# EAGLE design 8Bit-audio-7524-axelb (EAGLE 9.6.2)
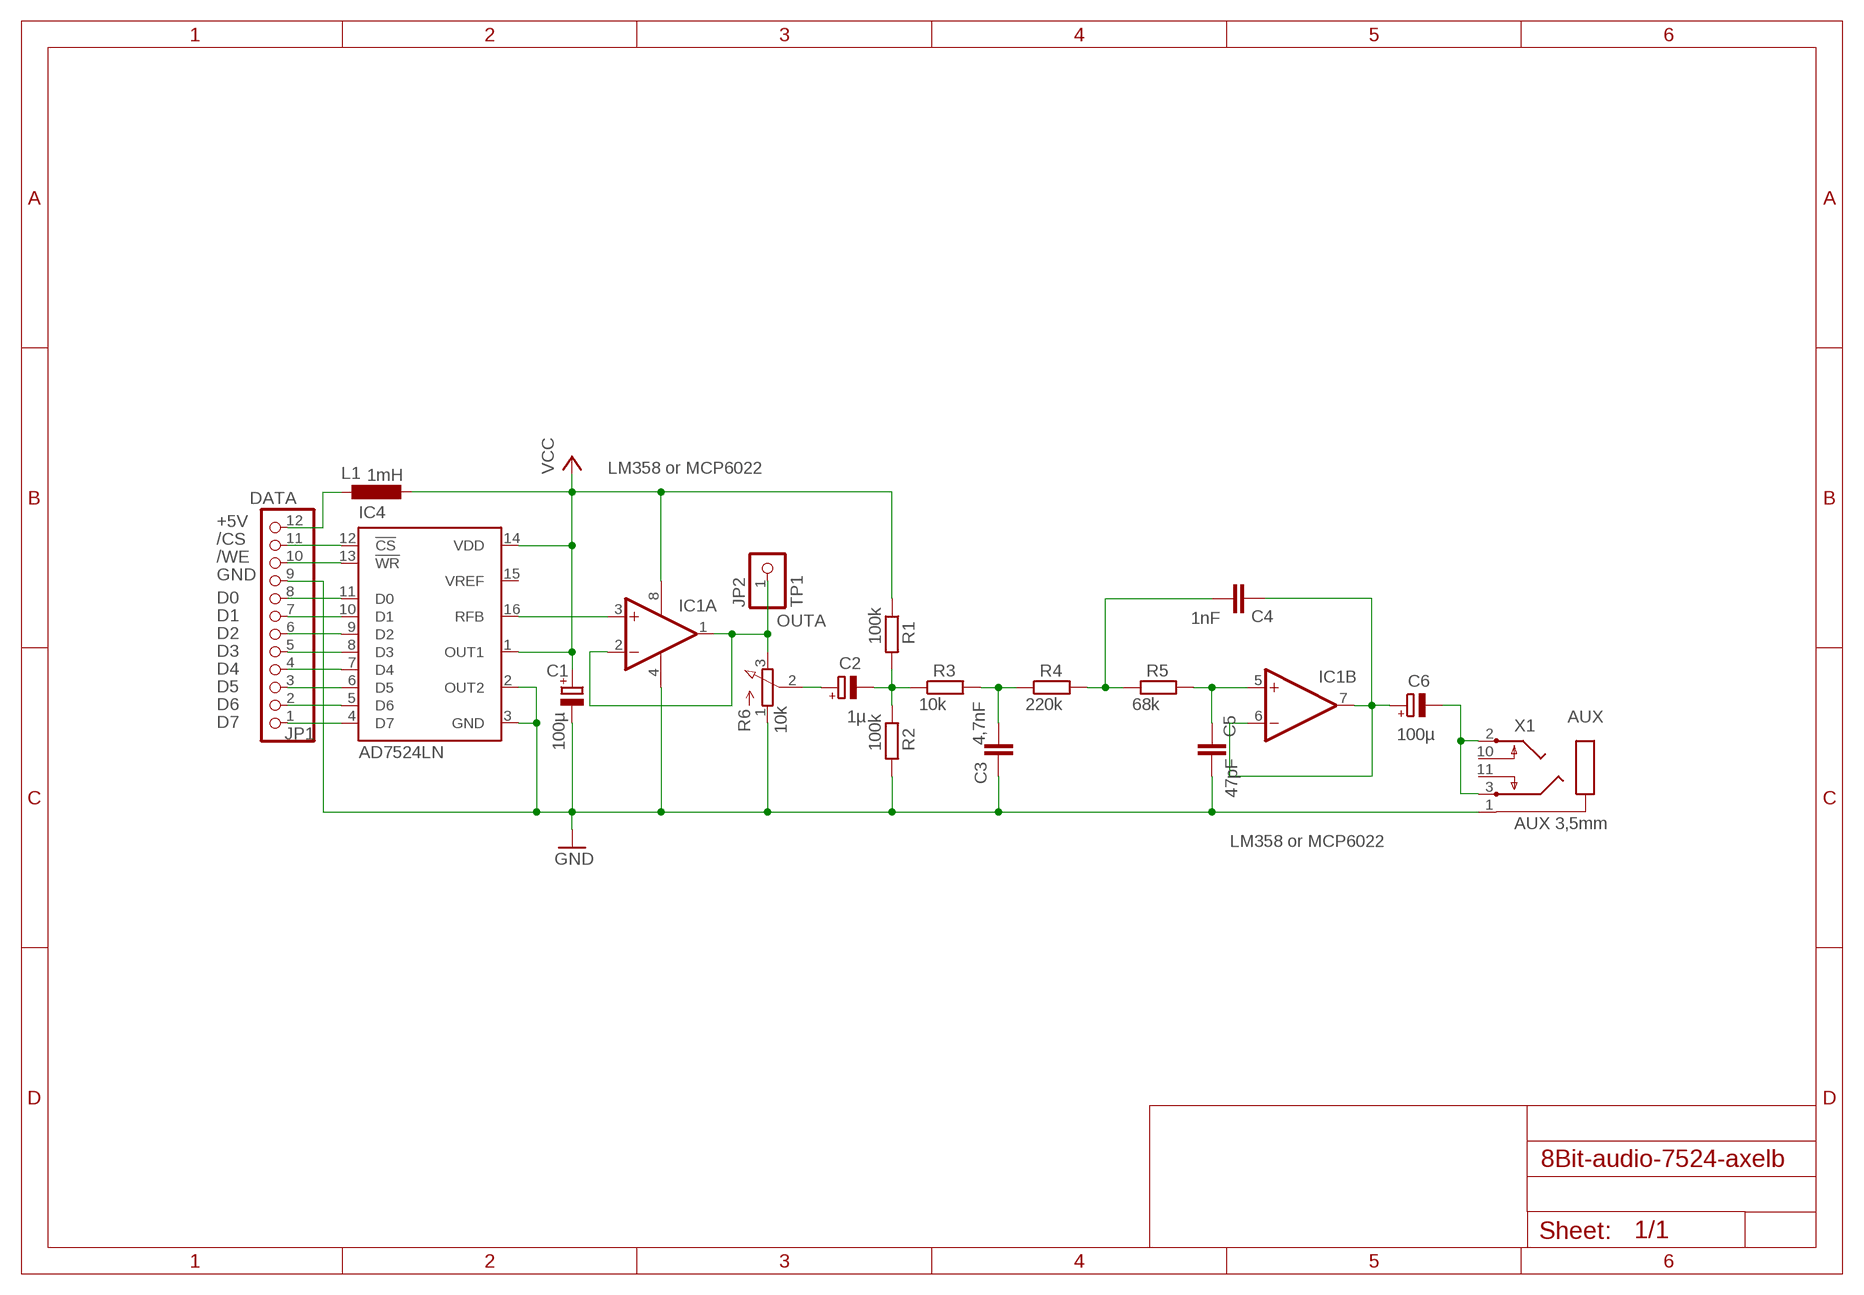
[diagram p0: schematic, sheet 1]

## Parts
C1  100µ  CPOL-EUE5-5  [E5-5]
C2  1µ  CPOL-EUE5-5  [E5-5]
C3  4,7nF  C-EU075-032X103  [C075-032X103]
C4  1nF  C-EU075-032X103  [C075-032X103]
C5  47pF  C-EU075-032X103  [C075-032X103]
C6  100µ  CPOL-EUE5-5  [E5-5]
IC1  LM358 or MCP6022  LM358N  [DIL08]
IC4  AD7524LN  [DIL16]
JP1  DATA  PINHD-1X12  [1X12]
JP2  TP1  PINHD-1X1  [1X01]
L1  1mH  L-EU0207/10  [0207/10]
R1  100k  R-EU_0207/10  [0207/10]
R2  100k  R-EU_0207/10  [0207/10]
R3  10k  R-EU_0207/10  [0207/10]
R4  220k  R-EU_0207/10  [0207/10]
R5  68k  R-EU_0207/10  [0207/10]
R6  10k  3RP/1610N  [3RP/1610N]
X1  AUX 3,5mm  CON-SJ1-352XNSJ1-352XN  [SJ1-352XN]

## Nets
+5V: JP1.12 L1.1
/CS: IC4.12(!CS) JP1.11
/WE: IC4.13(!WR) JP1.10
AUX: C6.- X1.2 X1.3
D0: IC4.11(D0) JP1.8
D1: IC4.10(D1) JP1.7
D2: IC4.9(D2) JP1.6
D3: IC4.8(D3) JP1.5
D4: IC4.7(D4) JP1.4
D5: IC4.6(D5) JP1.3
D6: IC4.5(D6) JP1.2
D7: IC4.4(D7) JP1.1
GND: C1.- C3.1 C5.2 IC1.4(P:V-) IC4.2(OUT2) IC4.3(GND) JP1.9 R2.2 R6.1(A) X1.1
N$1: IC1.3(A:+IN) IC4.16(RFB)
N$3: C2.- R1.2 R2.1 R3.1
N$5: C2.+ R6.2(S)
N$6: C3.2 R3.2 R4.1
N$7: C4.2 R4.2 R5.1
N$9: C5.1 IC1.5(B:+IN) R5.2
OUTA: IC1.1(A:OUT) IC1.2(A:-IN) JP2.1 R6.3(E)
OUTB: C4.1 C6.+ IC1.6(B:-IN) IC1.7(B:OUT)
VCC: C1.+ IC1.8(P:V+) IC4.1(OUT1) IC4.14(VDD) L1.2 R1.1
Unconnected: IC4.15(VREF) X1.10 X1.11

## Library data of the parts
C1 C2 C6 = rcl:CPOL-EU: POLARIZED CAPACITOR, European symbol; SPICEPREFIX: C
C3-C5 = rcl:C-EU: CAPACITOR, European symbol; SPICEPREFIX: C
IC1 = linear:LM358: OP AMP also LM158; LM258; LM2904 Source: http://cache.national.com/ds/LM/LM158.pdf
IC4 = analog-devices:AD7524*: 8-Bit Buffered Multiplying DAC Source: http://www.analog.com/UploadedFiles/Data_Sheets/888358036ad7524.pdf; MF: ALTERA CORPORATION; MPN: AD7524LNZ; OC_FARNELL: 9605401; OC_NEWARK: 59K4974
JP1 = pinhead:PINHD-1X12: PIN HEADER
JP2 = pinhead:PINHD-1X1: PIN HEADER
L1 = rcl:L-EU: INDUCTOR, European symbol; SPICEPREFIX: L
R1-R5 = rcl:R-EU_: RESISTOR, European symbol; SPICEPREFIX: R
R6 = pot:3RP/1610N: 16mm Potentiometer one level Source: http://www.alphapotentiometers.net/html/16mm_pot_2.html
X1 = CON SJ1-352XN:CON-SJ1-352XN: MIC/HEADPHONE JACK KS-S stereo microphone/headphone jack SJ1-352XN (CUD Devices)

## Board
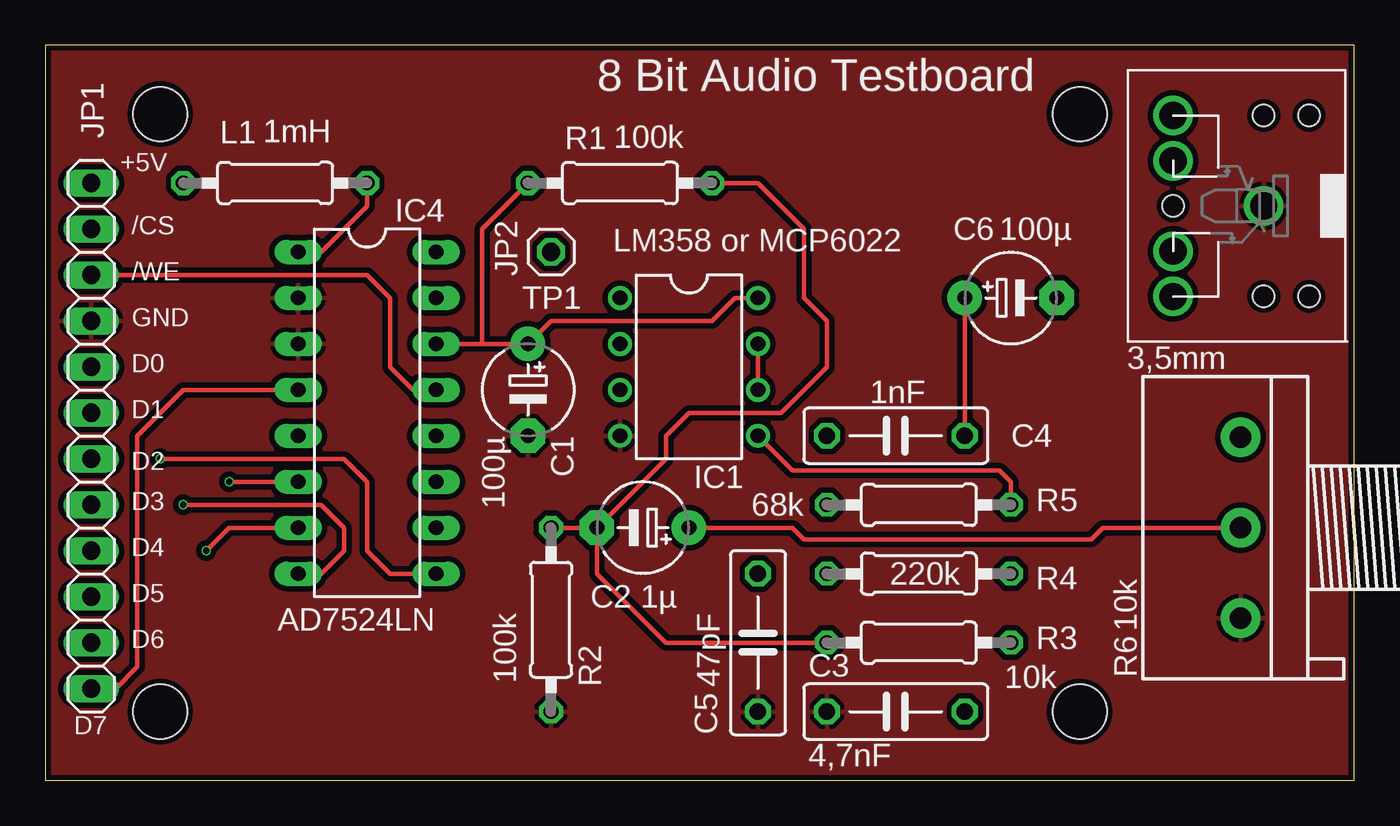
[diagram p1: board, top side]
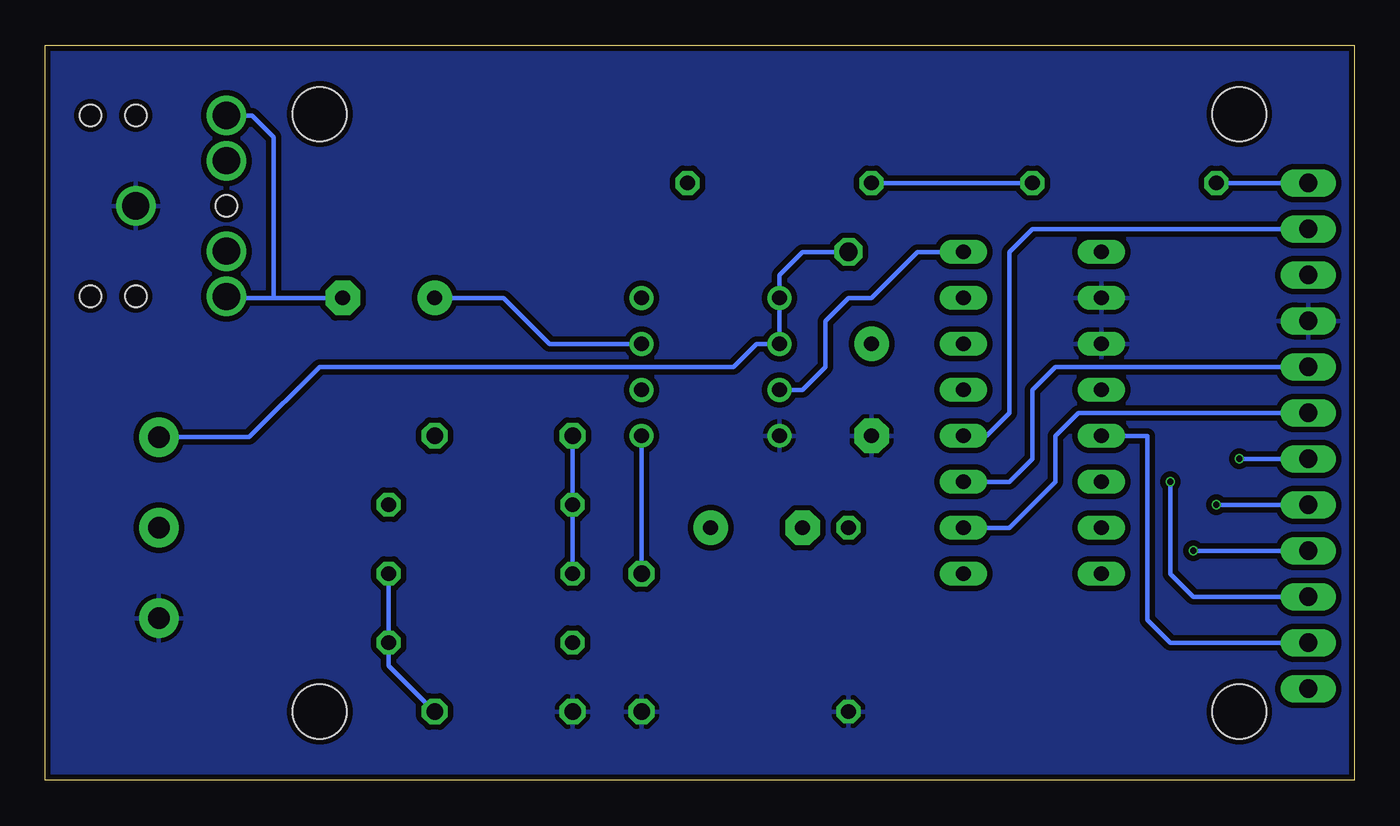
[diagram p2: board, bottom side, seen from below]

Size 72.31 x 40.63 mm. Coordinates in mm from the lower left corner, seen from the top.
Outline: 0,0 72.31,0 72.31,40.63 0,40.63 0,0
Copper layers (1*16): Top 0.035mm / dielectric 1.6mm / Bottom 0.035mm
Design rules "jlcpcb-2layers *": minimum track width 5mil, minimum drill 0.3mm, track to track 5mil, track to pad 5mil, pad to pad 5mil, via to via 5mil, smd to smd 5mil, copper to edge 0.2mm, drill to drill 6mil, minimum pad ring 10mil, minimum via ring 3mil, stop-mask expansion 4mil, vias tented up to drill 0mil, thermal gap 10mil
Holes 3 mm at 6.35,36.83 57.15,3.81 57.15,36.83 6.35,3.81

### Footprints (pad centres in the part's own frame; a part is rotated, then mirrored left to right if it is on the bottom)
E5-5 = drill 0.813 pad 1.905: + -2.54,0 | drill 0.813 pad 1.905 octagon: - 2.54,0
C075-032X103 = drill 0.914 octagon: 1 -3.81,0; 2 3.81,0
DIL08 = drill 0.813 pad 1.27: 1 -3.81,-3.81; 2 -1.27,-3.81; 3 1.27,-3.81; 4 3.81,-3.81; 5 3.81,3.81; 6 1.27,3.81; 7 -1.27,3.81; 8 -3.81,3.81
DIL16 = drill 0.813 long: 1 -8.89,-3.81; 2 -6.35,-3.81; 3 -3.81,-3.81; 4 -1.27,-3.81; 5 1.27,-3.81; 6 3.81,-3.81; 7 6.35,-3.81; 8 8.89,-3.81; 9 8.89,3.81; 10 6.35,3.81; 11 3.81,3.81; 12 1.27,3.81; 13 -1.27,3.81; 14 -3.81,3.81; 15 -6.35,3.81; 16 -8.89,3.81
1X12 = drill 1.016 long: 1 -13.97,0; 2 -11.43,0; 3 -8.89,0; 4 -6.35,0; 5 -3.81,0; 6 -1.27,0; 7 1.27,0; 8 3.81,0; 9 6.35,0; 10 8.89,0; 11 11.43,0; 12 13.97,0
1X01 = drill 1.016 octagon: 1 0,0
0207/10 = drill 0.813 octagon: 1 -5.08,0; 2 5.08,0
3RP/1610N = drill 1.2 pad 2.184: 1 -5,0; 2 0,0; 3 5,0
SJ1-352XN = drill 1.5 pad 2.184: 1 0,0; 2 5,-5; 3 5,5; 10 5,-2.5; 11 5,2.5 | hole 1.2: 5,0; 0,5; 0,-5; -2.5,-5; -2.5,5

### Placement (x,y rotation side)
C1  26.67,21.59 270 top
C2  33.02,13.97 180 top
C3  46.99,3.81 0 top
C4  46.99,19.05 180 top
C5  39.37,7.62 270 top
C6  53.34,26.67 0 top
IC1  35.56,22.86 270 top
IC4  17.78,20.32 270 top
JP1  2.54,19.05 90 top
JP2  27.94,29.21 0 top
L1  12.7,33.02 0 top
R1  31.75,33.02 0 top
R2  27.94,8.89 270 top
R3  48.26,7.62 0 top
R4  48.26,11.43 180 top
R5  48.26,15.24 0 top
R6  66.04,13.97 90 top
X1  67.31,31.75 180 top

### Tracks (layer width: path | path; a pad name or v marks a point on that pad's centre or on a via)
+5V
  Bottom 0.254: L1.1 JP1.12
/CS
  Bottom 0.254: IC4.12 20.32,19.05 19.05,20.32 19.05,29.21 17.78,30.48 JP1.11
/WE
  Top 0.254: JP1.10 17.78,27.94 19.05,26.67 19.05,22.86 20.32,21.59 IC4.13
AUX
  Bottom 0.254: X1.3 62.23,26.67 59.69,26.67 | 59.69,26.67 C6.- | X1.2 60.88,36.75 59.69,35.56 59.69,26.67
D0
  Bottom 0.254: IC4.11 19.05,16.51 17.78,17.78 17.78,21.59 16.51,22.86 JP1.8
D1
  Bottom 0.254: IC4.10 19.05,13.97 16.51,16.51 16.51,19.05 15.24,20.32 JP1.7
D2  (via drill 0.35)
  Top 0.254: IC4.9 19.05,11.43 17.78,12.7 17.78,16.51 16.51,17.78 v6.35,17.78
  Bottom 0.254: v6.35,17.78 JP1.6
D3  (via drill 0.35)
  Top 0.254: IC4.8 15.24,11.43 16.51,12.7 16.51,13.97 15.24,15.24 v7.62,15.24
  Bottom 0.254: v7.62,15.24 JP1.5
D4  (via drill 0.35)
  Top 0.254: IC4.7 10.16,13.97 v8.89,12.7
  Bottom 0.254: v8.89,12.7 JP1.4
D5  (via drill 0.35)
  Top 0.254: IC4.6 v10.16,16.51
  Bottom 0.254: v10.16,16.51 10.16,11.43 8.89,10.16 JP1.3
D6
  Bottom 0.254: IC4.5 11.43,19.05 11.43,8.89 10.16,7.62 JP1.2
D7
  Top 0.254: JP1.1 3.88,5.08 5.08,6.28 5.08,19.05 7.62,21.59 IC4.4
GND
  pour Bottom (isolate 0.305): 0,40.64 0,0 72.39,0 72.39,40.64
  pour Top (isolate 0.305): 0,40.64 0,0 72.39,0 72.39,40.64
N$1
  Bottom 0.254: IC1.3 30.48,21.59 29.21,22.86 29.21,25.4 27.94,26.67 26.67,26.67 24.13,29.21 IC4.16
N$3
  Top 0.254: R1.2 39.37,33.02 41.91,30.48 41.91,26.67 43.18,25.4 43.18,22.86 40.64,20.32 35.56,20.32 34.29,19.05 34.29,17.78 C2.- | C2.- R2.1 | R3.1 34.29,7.62 30.48,11.43 C2.-
N$5
  Top 0.254: R6.2 58.42,13.97 57.78,13.34 41.91,13.34 41.27,13.97 C2.+
N$6
  Bottom 0.254: R4.1 R3.2 53.34,6.35 C3.2
N$7
  Bottom 0.254: C4.2 R5.1 R4.2
N$9
  Top 0.254: R5.2 53.34,16.51 52.7,17.14 41.27,17.14 IC1.5
  Bottom 0.254: C5.1 IC1.5
OUTA
  Bottom 0.254: JP2.1 30.48,29.21 31.75,27.94 IC1.1 IC1.2 33.02,24.13 34.29,22.86 57.15,22.86 61.04,18.97 R6.3
OUTB
  Top 0.254: IC1.6 IC1.7 | C4.1 C6.+
  Bottom 0.254: IC1.7 44.45,24.13 46.99,26.67 C6.+
VCC
  Top 0.254: IC4.1 15.24,29.21 17.78,31.75 L1.2 | IC4.14 24.13,24.13 | 24.13,24.13 C1.+ 27.94,25.4 36.83,25.4 38.1,26.67 IC1.8 | R1.1 24.13,30.48 24.13,24.13
  Bottom 0.254: L1.2 R1.1

### Text on the board
tPlace: 8 Bit Audio Testboard | +5V | /CS | /WE | GND | D0 | D1 | D2 | D3 | D4 | D5 | D6 | D7